# EAGLE design main (EAGLE 9.3.1)

## Sheet 1 of 5: Motor Connection
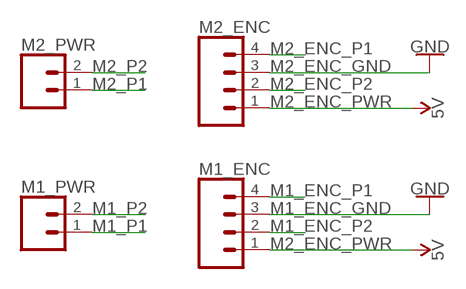
[diagram p0: schematic, sheet 1]

### Parts
M1_ENC  CONN_04  [1X04]
M1_PWR  CONN_02PTH4  [1X02_XTRA_BIG]
M2_ENC  CONN_04  [1X04]
M2_PWR  CONN_02PTH4  [1X02_XTRA_BIG]

### Nets
M1_ENC_GND: M1_ENC.3 ; supply symbol labelled GND
M1_ENC_P1: M1_ENC.4 ; also sheet 4
M1_ENC_P2: M1_ENC.2 ; also sheet 4
M1_P1: M1_PWR.1 ; also sheet 2
M1_P2: M1_PWR.2 ; also sheet 2
M2_ENC_GND: M2_ENC.3 ; supply symbol labelled GND
M2_ENC_P1: M2_ENC.4 ; also sheet 4
M2_ENC_P2: M2_ENC.2 ; also sheet 4
M2_ENC_PWR: M1_ENC.1 M2_ENC.1 ; supply symbol labelled 5V
M2_P1: M2_PWR.1 ; also sheet 2
M2_P2: M2_PWR.2 ; also sheet 2

## Sheet 2 of 5: Motor Drive
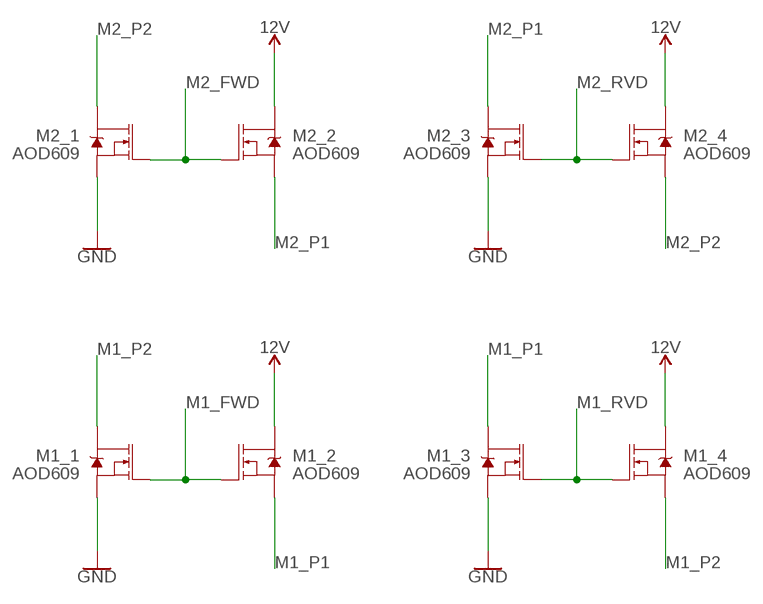
[diagram p1: schematic, sheet 2]

### Parts
M1_1  AOD609  MOSFET-NCH-FDD8780  [DPAK]
M1_2  AOD609  MOSFET-NCH-FDD8780  [DPAK]
M1_3  AOD609  MOSFET-NCH-FDD8780  [DPAK]
M1_4  AOD609  MOSFET-NCH-FDD8780  [DPAK]
M2_1  AOD609  MOSFET-NCH-FDD8780  [DPAK]
M2_2  AOD609  MOSFET-NCH-FDD8780  [DPAK]
M2_3  AOD609  MOSFET-NCH-FDD8780  [DPAK]
M2_4  AOD609  MOSFET-NCH-FDD8780  [DPAK]

### Nets
12V: M1_2.4(D) M1_4.4(D) M2_2.4(D) M2_4.4(D)
GND: M1_1.3(S) M1_3.3(S) M2_1.3(S) M2_3.3(S) ; also sheet 3,4,5
M1_FWD: M1_1.1(G) M1_2.1(G) ; also sheet 4
M1_P1: M1_2.3(S) M1_3.4(D) ; also sheet 1
M1_P2: M1_1.4(D) M1_4.3(S) ; also sheet 1
M1_RVD: M1_3.1(G) M1_4.1(G) ; also sheet 4
M2_FWD: M2_1.1(G) M2_2.1(G) ; also sheet 4
M2_P1: M2_2.3(S) M2_3.4(D) ; also sheet 1
M2_P2: M2_1.4(D) M2_4.3(S) ; also sheet 1
M2_RVD: M2_3.1(G) M2_4.1(G) ; also sheet 4

## Sheet 3 of 5: IMU
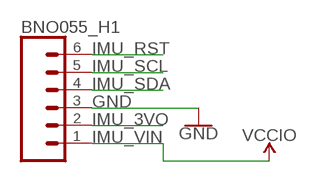
[diagram p2: schematic, sheet 3]

### Parts
BNO055_H1  CONN_06SILK_FEMALE_PTH  [1X06]

### Nets
GND: BNO055_H1.3 ; also sheet 2,4,5
IMU_3VO: BNO055_H1.2
IMU_RST: BNO055_H1.6
IMU_SCL: BNO055_H1.5 ; also sheet 4
IMU_SDA: BNO055_H1.4 ; also sheet 4
IMU_VIN: BNO055_H1.1 ; supply symbol labelled VCCIO

## Sheet 4 of 5: Pyboard
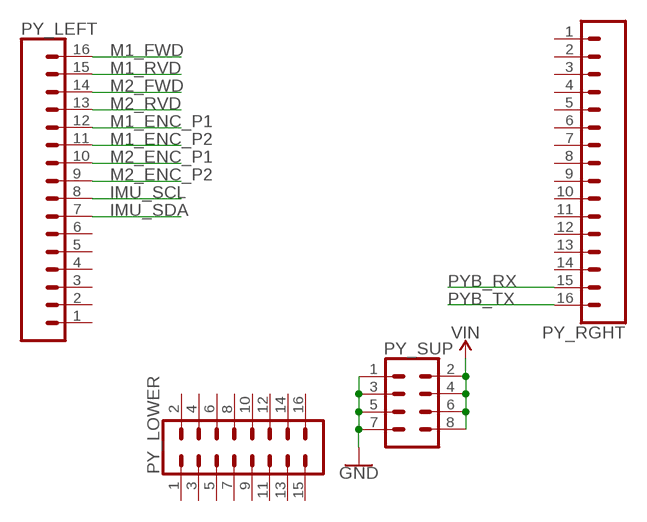
[diagram p3: schematic, sheet 4]

### Parts
PY_LEFT  CONN_16  [1X16]
PY_LOWER  CONN_08X2  [2X8]
PY_RGHT  CONN_16  [1X16]
PY_SUP  CONN_04X2  [2X4]

### Nets
GND: PY_SUP.1 PY_SUP.3 PY_SUP.5 PY_SUP.7 ; also sheet 2,3,5
IMU_SCL: PY_LEFT.8 ; also sheet 3
IMU_SDA: PY_LEFT.7 ; also sheet 3
M1_ENC_P1: PY_LEFT.12 ; also sheet 1
M1_ENC_P2: PY_LEFT.11 ; also sheet 1
M1_FWD: PY_LEFT.16 ; also sheet 2
M1_RVD: PY_LEFT.15 ; also sheet 2
M2_ENC_P1: PY_LEFT.10 ; also sheet 1
M2_ENC_P2: PY_LEFT.9 ; also sheet 1
M2_FWD: PY_LEFT.14 ; also sheet 2
M2_RVD: PY_LEFT.13 ; also sheet 2
PYB_RX: PY_RGHT.15 ; also sheet 5
PYB_TX: PY_RGHT.16 ; also sheet 5
VIN: PY_SUP.2 PY_SUP.4 PY_SUP.6 PY_SUP.8
Unconnected: PY_LEFT.1 PY_LEFT.2 PY_LEFT.3 PY_LEFT.4 PY_LEFT.5 PY_LEFT.6 PY_LOWER.1 PY_LOWER.2 PY_LOWER.3 PY_LOWER.4 PY_LOWER.5 PY_LOWER.6 PY_LOWER.7 PY_LOWER.8 PY_LOWER.9 PY_LOWER.10 PY_LOWER.11 PY_LOWER.12 PY_LOWER.13 PY_LOWER.14 PY_LOWER.15 PY_LOWER.16 PY_RGHT.1 PY_RGHT.2 PY_RGHT.3 PY_RGHT.4 PY_RGHT.5 PY_RGHT.6 PY_RGHT.7 PY_RGHT.8 PY_RGHT.9 PY_RGHT.10 PY_RGHT.11 PY_RGHT.12 PY_RGHT.13 PY_RGHT.14

## Sheet 5 of 5: Raspberry Pi
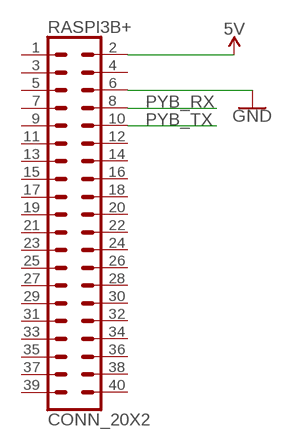
[diagram p4: schematic, sheet 5]

### Parts
RASPI3B+  CONN_20X2  [2X20]

### Nets
5V: RASPI3B+.2
GND: RASPI3B+.6 ; also sheet 2,3,4
PYB_RX: RASPI3B+.8 ; also sheet 4
PYB_TX: RASPI3B+.10 ; also sheet 4
Unconnected: RASPI3B+.1 RASPI3B+.3 RASPI3B+.4 RASPI3B+.5 RASPI3B+.7 RASPI3B+.9 RASPI3B+.11 RASPI3B+.12 RASPI3B+.13 RASPI3B+.14 RASPI3B+.15 RASPI3B+.16 RASPI3B+.17 RASPI3B+.18 RASPI3B+.19 RASPI3B+.20 RASPI3B+.21 RASPI3B+.22 RASPI3B+.23 RASPI3B+.24 RASPI3B+.25 RASPI3B+.26 RASPI3B+.27 RASPI3B+.28 RASPI3B+.29 RASPI3B+.30 RASPI3B+.31 RASPI3B+.32 RASPI3B+.33 RASPI3B+.34 RASPI3B+.35 RASPI3B+.36 RASPI3B+.37 RASPI3B+.38 RASPI3B+.39 RASPI3B+.40

## Library data of the parts
BNO055_H1 = SparkFun-Connectors:CONN_06: Multi connection point. Often used as Generic Header-pin footprint for 0.1 inch spaced/style header connections On any of the 0.1 inch spaced packages, you can populate with these: Break Away Headers - Straight <https://www.sparkfun.com/products/116> (PRT-00116) Break Away Male Headers - Right Angle <https://www.sparkfun.com/products/553> (PRT-00553) Female Headers <https://www.sparkfun.com/products/115> (PRT-00115) Break Away Headers - Machine Pin <https://www.sparkfun.com/products/117> (PRT-00117) Break Away Female Headers - Swiss Machine Pin <https://www.sparkfun.com/products/743> (PRT-00743) Arduino Stackable Header - 6 Pin <https://www.sparkfun.com/products/9280> (PRT-09280) For SCREWTERMINALS and SPRING TERMINALS visit here: Screw Terimnals on SparkFun.com <https://www.sparkfun.com/search/results?term=Screw+Terminals> (5mm/3.5mm/2.54mm spacing) This device is also useful as a general connection point to wire up your design to another part of your project. Our various solder wires solder well into these plated through hole pads. Hook-Up Wire - Assortment (Stranded, 22 AWG) <https://www.sparkfun.com/products/11375> (PRT-11375) Hook-Up Wire - Assortment (Solid Core, 22 AWG) <https://www.sparkfun.com/products/11367> (PRT-11367) View the entire wire category on our website here <https://www.sparkfun.com/categories/141>; PROD_ID: CONN-08437
M1_1-M1_4 M2_1-M2_4 = SparkFun-DiscreteSemi:MOSFET-NCH: N-channel MOSFETs Voltage controlled devices that allow control of high current outputs. SparkFun Products: SparkFun OpenScale <https://www.sparkfun.com/products/13261> SparkFun Digital Sandbox <https://www.sparkfun.com/products/12651> SparkFun Monster Moto Shield <https://www.sparkfun.com/products/10182> SparkFun MOSFET Power Controller <https://www.sparkfun.com/products/11214>; PROD_ID: TRANS-09984; VALUE: 35A/25V/8.5mΩ
M1_ENC M2_ENC = SparkFun-Connectors:CONN_04: Multi connection point. Often used as Generic Header-pin footprint for 0.1 inch spaced/style header connections On any of the 0.1 inch spaced packages, you can populate with these: Break Away Headers - Straight <https://www.sparkfun.com/products/116> (PRT-00116) Break Away Male Headers - Right Angle <https://www.sparkfun.com/products/553> (PRT-00553) Female Headers <https://www.sparkfun.com/products/115> (PRT-00115) Break Away Headers - Machine Pin <https://www.sparkfun.com/products/117> (PRT-00117) Break Away Female Headers - Swiss Machine Pin <https://www.sparkfun.com/products/743> (PRT-00743) For SCREWTERMINALS and SPRING TERMINALS visit here: Screw Terimnals on SparkFun.com <https://www.sparkfun.com/search/results?term=Screw+Terminals> (5mm/3.5mm/2.54mm spacing) This device is also useful as a general connection point to wire up your design to another part of your project. Our various solder wires solder well into these plated through hole pads. Hook-Up Wire - Assortment (Stranded, 22 AWG) <https://www.sparkfun.com/products/11375> (PRT-11375) Hook-Up Wire - Assortment (Solid Core, 22 AWG) <https://www.sparkfun.com/products/11367> (PRT-11367) View the entire wire category on our website here <https://www.sparkfun.com/categories/141> Special notes: Molex polarized connector foot print use with SKU : PRT-08231 with associated crimp pins and housings. 1MM SMD Version SKU: PRT-10208; PROD_ID: CONN-09696
M1_PWR M2_PWR = SparkFun-Connectors:CONN_02: Multi connection point. Often used as Generic Header-pin footprint for 0.1 inch spaced/style header connections On any of the 0.1 inch spaced packages, you can populate with these: Break Away Headers - Straight <https://www.sparkfun.com/products/116> (PRT-00116) Break Away Male Headers - Right Angle <https://www.sparkfun.com/products/553> (PRT-00553) Female Headers <https://www.sparkfun.com/products/115> (PRT-00115) Break Away Headers - Machine Pin <https://www.sparkfun.com/products/117> (PRT-00117) Break Away Female Headers - Swiss Machine Pin <https://www.sparkfun.com/products/743> (PRT-00743) For SCREWTERMINALS and SPRING TERMINALS visit here: Screw Terimnals on SparkFun.com <https://www.sparkfun.com/search/results?term=Screw+Terminals> (5mm/3.5mm/2.54mm spacing) This device is also useful as a general connection point to wire up your design to another part of your project. Our various solder wires solder well into these plated through hole pads. Hook-Up Wire - Assortment (Stranded, 22 AWG) <https://www.sparkfun.com/products/11375> (PRT-11375) Hook-Up Wire - Assortment (Solid Core, 22 AWG) <https://www.sparkfun.com/products/11367> (PRT-11367) View the entire wire category on our website here <https://www.sparkfun.com/categories/141> Special notes: Molex polarized connector foot print use with: PRT-08233 with associated crimp pins and housings. 2.54_SCREWTERM for use with PRT-10571. 3.5mm Screw Terminal footprints for PRT-08084 5mm Screw Terminal footprints for use with PRT-08432
PY_LEFT PY_RGHT = SparkFun-Connectors:CONN_16: Multi connection point. Often used as Generic Header-pin footprint for 0.1 inch spaced/style header connections On any of the 0.1 inch spaced packages, you can populate with these: Break Away Headers - Straight <https://www.sparkfun.com/products/116> (PRT-00116) Break Away Male Headers - Right Angle <https://www.sparkfun.com/products/553> (PRT-00553) Female Headers <https://www.sparkfun.com/products/115> (PRT-00115) Break Away Headers - Machine Pin <https://www.sparkfun.com/products/117> (PRT-00117) Break Away Female Headers - Swiss Machine Pin <https://www.sparkfun.com/products/743> (PRT-00743) For SCREWTERMINALS and SPRING TERMINALS visit here: Screw Terimnals on SparkFun.com <https://www.sparkfun.com/search/results?term=Screw+Terminals> (5mm/3.5mm/2.54mm spacing) This device is also useful as a general connection point to wire up your design to another part of your project. Our various solder wires solder well into these plated through hole pads. Hook-Up Wire - Assortment (Stranded, 22 AWG) <https://www.sparkfun.com/products/11375> (PRT-11375) Hook-Up Wire - Assortment (Solid Core, 22 AWG) <https://www.sparkfun.com/products/11367> (PRT-11367) View the entire wire category on our website here <https://www.sparkfun.com/categories/141> Special notes: Molex polarized connector foot print use with SKU : PRT-08231 with associated crimp pins and housings. 1MM SMD Version SKU: PRT-10208 NOTES ON THE VARIANTS LOCK and LOCK_LONGPADS... This footprint was designed to help hold the alignment of a through-hole component (i.e. 6-pin header) while soldering it into place. You may notice that each hole has been shifted either up or down by 0.005 of an inch from it's more standard position (which is a perfectly straight line). This slight alteration caused the pins (the squares in the middle) to touch the edges of the holes. Because they are alternating, it causes a "brace" to hold the component in place. 0.005 has proven to be the perfect amount of "off-center" position when using our standard breakaway headers. Although looks a little odd when you look at the bare footprint, once you have a header in there, the alteration is very hard to notice. Also,if you push a header all the way into place, it is covered up entirely on the bottom side.
PY_LOWER = SparkFun-Connectors:CONN_08X2: Multi connection point. Often used as Generic Header-pin footprint for 0.1 inch spaced/style header connections You can populate with any combo of single row headers, but if you'd like an exact match, check this: Header - 2x8 (Male, 0.1") <https://www.sparkfun.com/products/13156> (PRT-13156) On any of the 0.1 inch spaced packages, you can populate with these: Break Away Headers - Straight <https://www.sparkfun.com/products/116> (PRT-00116) Break Away Male Headers - Right Angle <https://www.sparkfun.com/products/553> (PRT-00553) Female Headers <https://www.sparkfun.com/products/115> (PRT-00115) Break Away Headers - Machine Pin <https://www.sparkfun.com/products/117> (PRT-00117) Break Away Female Headers - Swiss Machine Pin <https://www.sparkfun.com/products/743> (PRT-00743); SPICEPREFIX: X
PY_SUP = SparkFun-Connectors:CONN_04X2: Multi connection point. Often used as Generic Header-pin footprint for 0.1 inch spaced/style header connections On any of the 0.1 inch spaced packages, you can populate with these: Break Away Headers - Straight <https://www.sparkfun.com/products/116> (PRT-00116) Break Away Male Headers - Right Angle <https://www.sparkfun.com/products/553> (PRT-00553) Female Headers <https://www.sparkfun.com/products/115> (PRT-00115) Break Away Headers - Machine Pin <https://www.sparkfun.com/products/117> (PRT-00117) Break Away Female Headers - Swiss Machine Pin <https://www.sparkfun.com/products/743> (PRT-00743)
RASPI3B+ = SparkFun-Connectors:CONN_20X2: Multi connection point. Often used as Generic Header-pin footprint for 0.1 inch spaced/style header connections On any of the 0.1 inch spaced packages, you can populate with these: Break Away Headers - Straight <https://www.sparkfun.com/products/116> (PRT-00116) Break Away Male Headers - Right Angle <https://www.sparkfun.com/products/553> (PRT-00553) Female Headers <https://www.sparkfun.com/products/115> (PRT-00115) Break Away Headers - Machine Pin <https://www.sparkfun.com/products/117> (PRT-00117) Break Away Female Headers - Swiss Machine Pin <https://www.sparkfun.com/products/743> (PRT-00743)

## Board
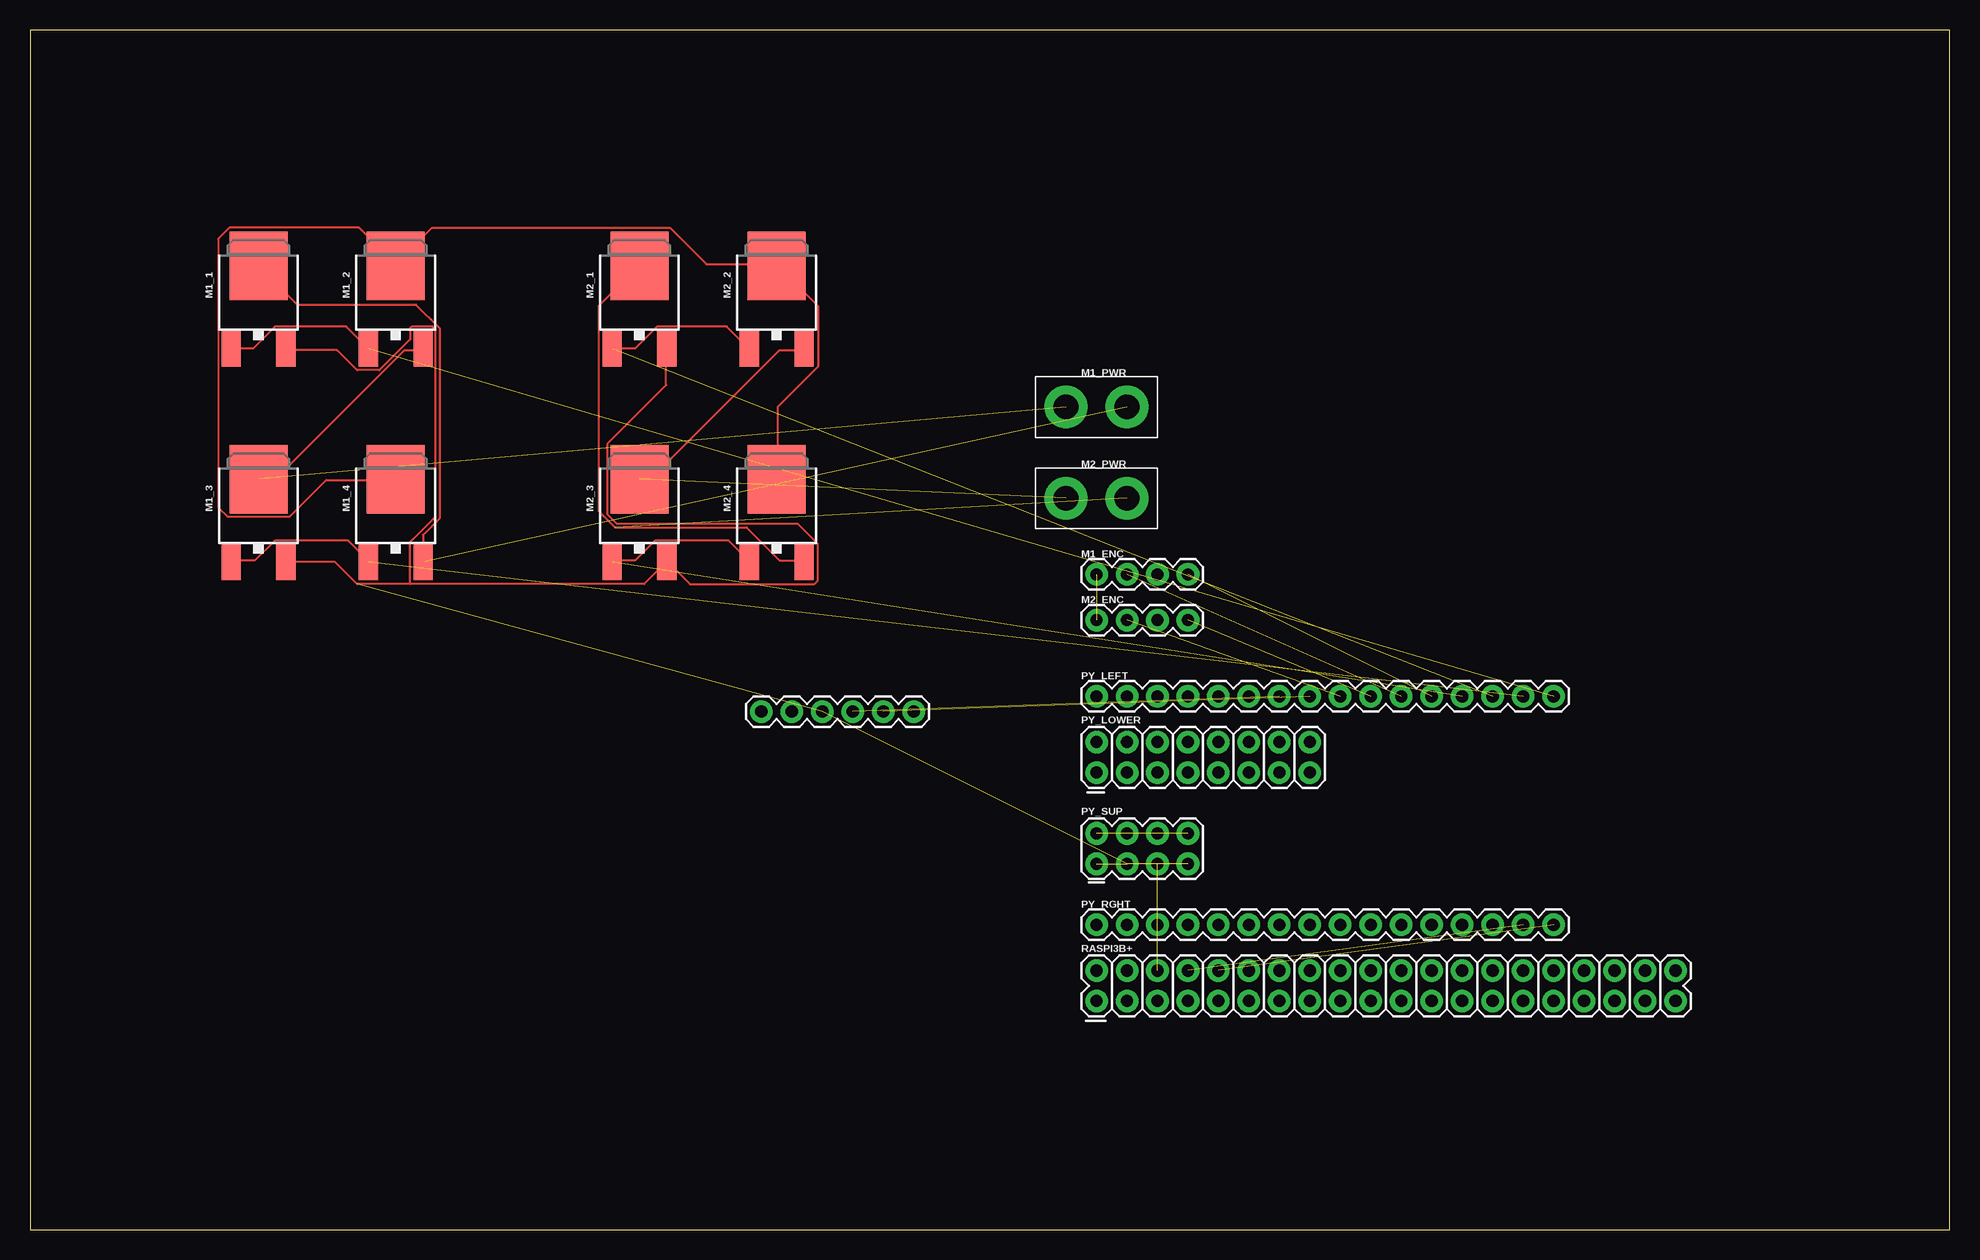
[diagram p5: board, top side]
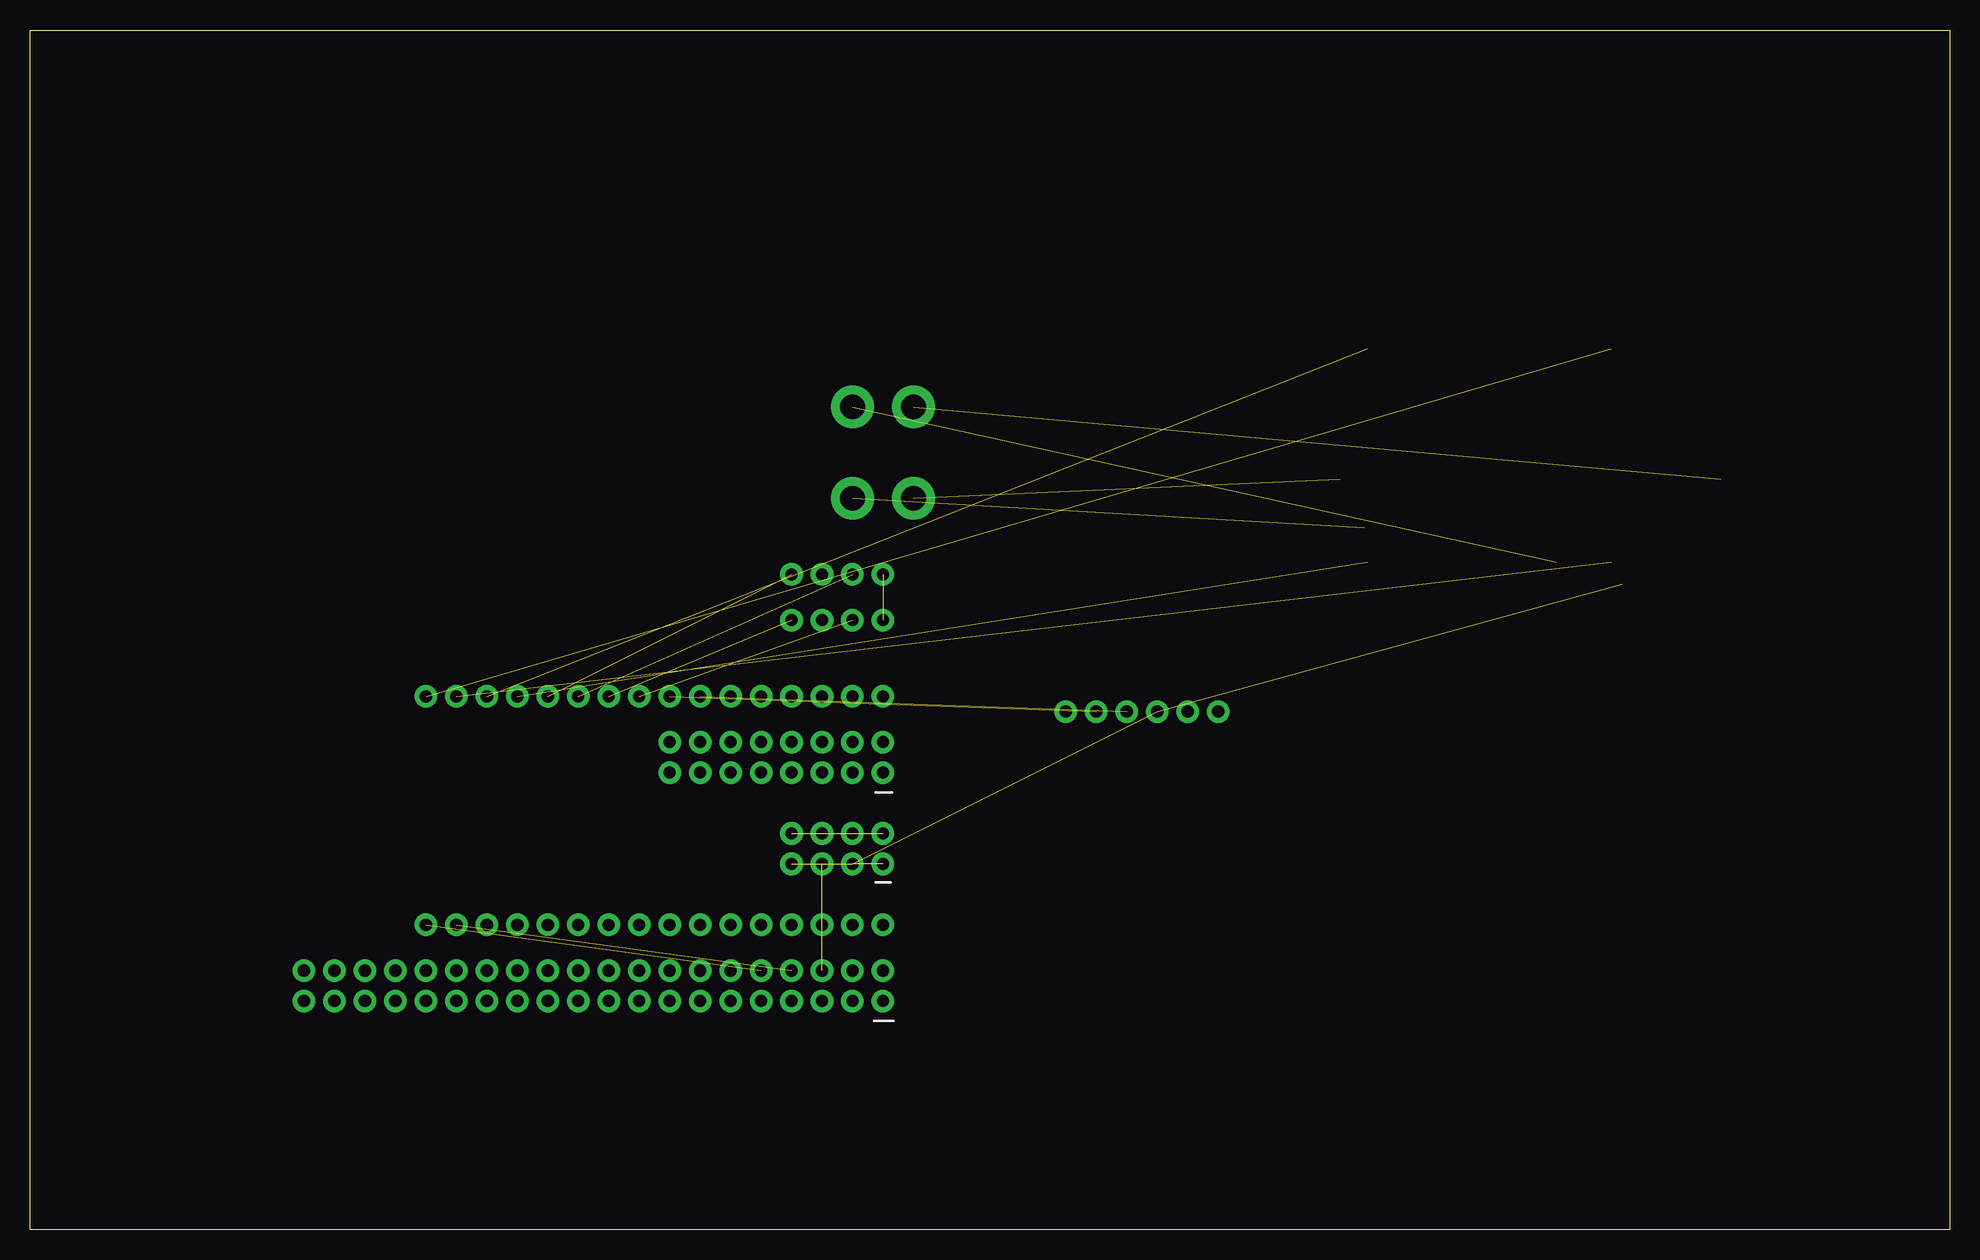
[diagram p6: board, bottom side, seen from below]

Size 160 x 100 mm. Coordinates in mm from the lower left corner, seen from the top.
Outline: 0,0 160,0 160,100 0,100 0,0
Copper layers (1*16): Top 0.035mm / dielectric 0.15mm / Bottom 0.035mm
Design rules "default": minimum track width 6mil, minimum drill 0.35mm, track to track 6mil, track to pad 6mil, pad to pad 6mil, via to via 6mil, smd to smd 6mil, copper to edge 40mil, drill to drill 6mil, minimum pad ring 10mil, minimum via ring 8mil, stop-mask expansion 4mil, vias tented up to drill 0mil, thermal gap 10mil

### Footprints (pad centres in the part's own frame; a part is rotated, then mirrored left to right if it is on the bottom)
1X06 = drill 1.016 pad 1.88: 1 0,0; 2 2.54,0; 3 5.08,0; 4 7.62,0; 5 10.16,0; 6 12.7,0
DPAK = smd 1.6 x 3: 1 -2.28,-5.31; 3 2.28,-5.31 | smd 4.826 x 5.715: 4 0,1.588
1X04 = drill 1.016 pad 1.88: 1 0,0; 2 2.54,0; 3 5.08,0; 4 7.62,0
1X02_XTRA_BIG = drill 2.057 pad 3.556: 1 -2.54,0; 2 2.54,0
1X16 = drill 1.016 pad 1.88: 1 0,0; 2 2.54,0; 3 5.08,0; 4 7.62,0; 5 10.16,0; 6 12.7,0; 7 15.24,0; 8 17.78,0; 9 20.32,0; 10 22.86,0; 11 25.4,0; 12 27.94,0; 13 30.48,0; 14 33.02,0; 15 35.56,0; 16 38.1,0
2X8 = drill 1.016 pad 1.88: 1 0,0; 2 0,2.54; 3 2.54,0; 4 2.54,2.54; 5 5.08,0; 6 5.08,2.54; 7 7.62,0; 8 7.62,2.54; 9 10.16,0; 10 10.16,2.54; 11 12.7,0; 12 12.7,2.54; 13 15.24,0; 14 15.24,2.54; 15 17.78,0; 16 17.78,2.54
2X4 = drill 1.016 pad 1.88: 1 -3.81,-1.27; 2 -3.81,1.27; 3 -1.27,-1.27; 4 -1.27,1.27; 5 1.27,-1.27; 6 1.27,1.27; 7 3.81,-1.27; 8 3.81,1.27
2X20 = drill 1.016 pad 1.88: 1 0,0; 2 0,2.54; 3 2.54,0; 4 2.54,2.54; 5 5.08,0; 6 5.08,2.54; 7 7.62,0; 8 7.62,2.54; 9 10.16,0; 10 10.16,2.54; 11 12.7,0; 12 12.7,2.54; 13 15.24,0; 14 15.24,2.54; 15 17.78,0; 16 17.78,2.54; 17 20.32,0; 18 20.32,2.54; 19 22.86,0; 20 22.86,2.54; 21 25.4,0; 22 25.4,2.54; 23 27.94,0; 24 27.94,2.54; 25 30.48,0; 26 30.48,2.54; 27 33.02,0; 28 33.02,2.54; 29 35.56,0; 30 35.56,2.54; 31 38.1,0; 32 38.1,2.54; 33 40.64,0; 34 40.64,2.54; 35 43.18,0; 36 43.18,2.54; 37 45.72,0; 38 45.72,2.54; 39 48.26,0; 40 48.26,2.54

### Placement (x,y rotation side)
BNO055_H1  60.96,43.18 0 top
M1_1  19.05,78.74 0 top
M1_2  30.48,78.74 0 top
M1_3  19.05,60.96 0 top
M1_4  30.48,60.96 0 top
M1_ENC  88.9,54.61 0 top
M1_PWR  88.9,68.58 0 top
M2_1  50.8,78.74 0 top
M2_2  62.23,78.74 0 top
M2_3  50.8,60.96 0 top
M2_4  62.23,60.96 0 top
M2_ENC  88.9,50.8 0 top
M2_PWR  88.9,60.96 0 top
PY_LEFT  88.9,44.45 0 top
PY_LOWER  88.9,38.1 0 top
PY_RGHT  88.9,25.4 0 top
PY_SUP  92.71,31.75 0 top
RASPI3B+  88.9,19.05 0 top

### Tracks (layer width: path | path; a pad name or v marks a point on that pad's centre or on a via)
12V
  Top 0.152: M2_4.4 62.33,62.64 62.33,68.58 65.68,71.93 65.68,76.96 62.33,80.31 M2_2.4 62.18,80.47 56.39,80.47 53.34,83.52 33.53,83.52 30.48,80.47 | 30.48,80.47 27.43,83.52 16.61,83.52 15.7,82.6 15.7,60.2 16.46,59.44 21.64,59.44 24.69,62.48 30.48,62.48 M1_4.4 | 30.48,80.47 M1_2.4
GND  (6 unrouted)
  Top 0.152: 31.7,53.8 51.21,53.8 53.03,55.63 M2_3.3 53.19,55.63 55.02,53.8 65.38,53.8 65.68,54.1 65.68,57.15 64.01,58.83 48.92,58.83 48.16,59.59 48.16,65.53 53.03,70.41 53.03,73.3 M2_1.3 | 31.7,53.8 27.28,53.8 25.45,55.63 21.34,55.63 M1_3.3 | 31.7,53.8 31.7,57.3 33.83,59.44 33.83,74.98 33.53,75.29 31.85,75.29 31.7,75.13 31.7,74.22 29.11,71.63 27.28,71.63 25.6,73.3 21.34,73.3 M1_1.3
IMU_SCL  (1 unrouted)
IMU_SDA  (1 unrouted)
M1_ENC_P1  (1 unrouted)
M1_ENC_P2  (1 unrouted)
M1_FWD  (1 unrouted)
  Top 0.152: M1_1.1 16.92,73.46 18.59,73.46 20.42,75.29 26.36,75.29 28.19,73.46 M1_2.1
M1_P1  (1 unrouted)
  Top 0.152: M1_2.3 32.61,73.3 31.24,73.3 20.57,62.64 19.05,62.64 M1_3.4
M1_P2  (1 unrouted)
  Top 0.152: M1_4.3 32.77,55.78 32.77,57.91 34.14,59.28 34.14,75.13 32.16,77.11 22.25,77.11 19.05,80.31 M1_1.4
M1_RVD  (1 unrouted)
  Top 0.152: M1_3.1 16.92,55.78 18.75,55.78 20.42,57.45 26.52,57.45 28.19,55.78 M1_4.1
M2_ENC_P1  (1 unrouted)
M2_ENC_P2  (1 unrouted)
M2_ENC_PWR  (1 unrouted)
M2_FWD  (1 unrouted)
  Top 0.152: M2_1.1 48.62,73.46 50.44,73.46 52.27,75.29 58.06,75.29 59.89,73.46 M2_2.1
M2_P1  (1 unrouted)
  Top 0.152: M2_2.3 64.47,73.3 62.48,73.3 51.82,62.64 50.9,62.64 M2_3.4
M2_P2  (1 unrouted)
  Top 0.152: M2_4.3 64.47,55.78 62.48,55.78 59.74,58.52 48.77,58.52 47.4,59.89 47.4,76.96 50.75,80.31 M2_1.4
M2_RVD  (1 unrouted)
  Top 0.152: M2_3.1 48.62,55.78 50.44,55.78 52.12,57.45 58.22,57.45 59.89,55.78 M2_4.1
PYB_RX  (1 unrouted)
PYB_TX  (1 unrouted)
VIN  (3 unrouted)